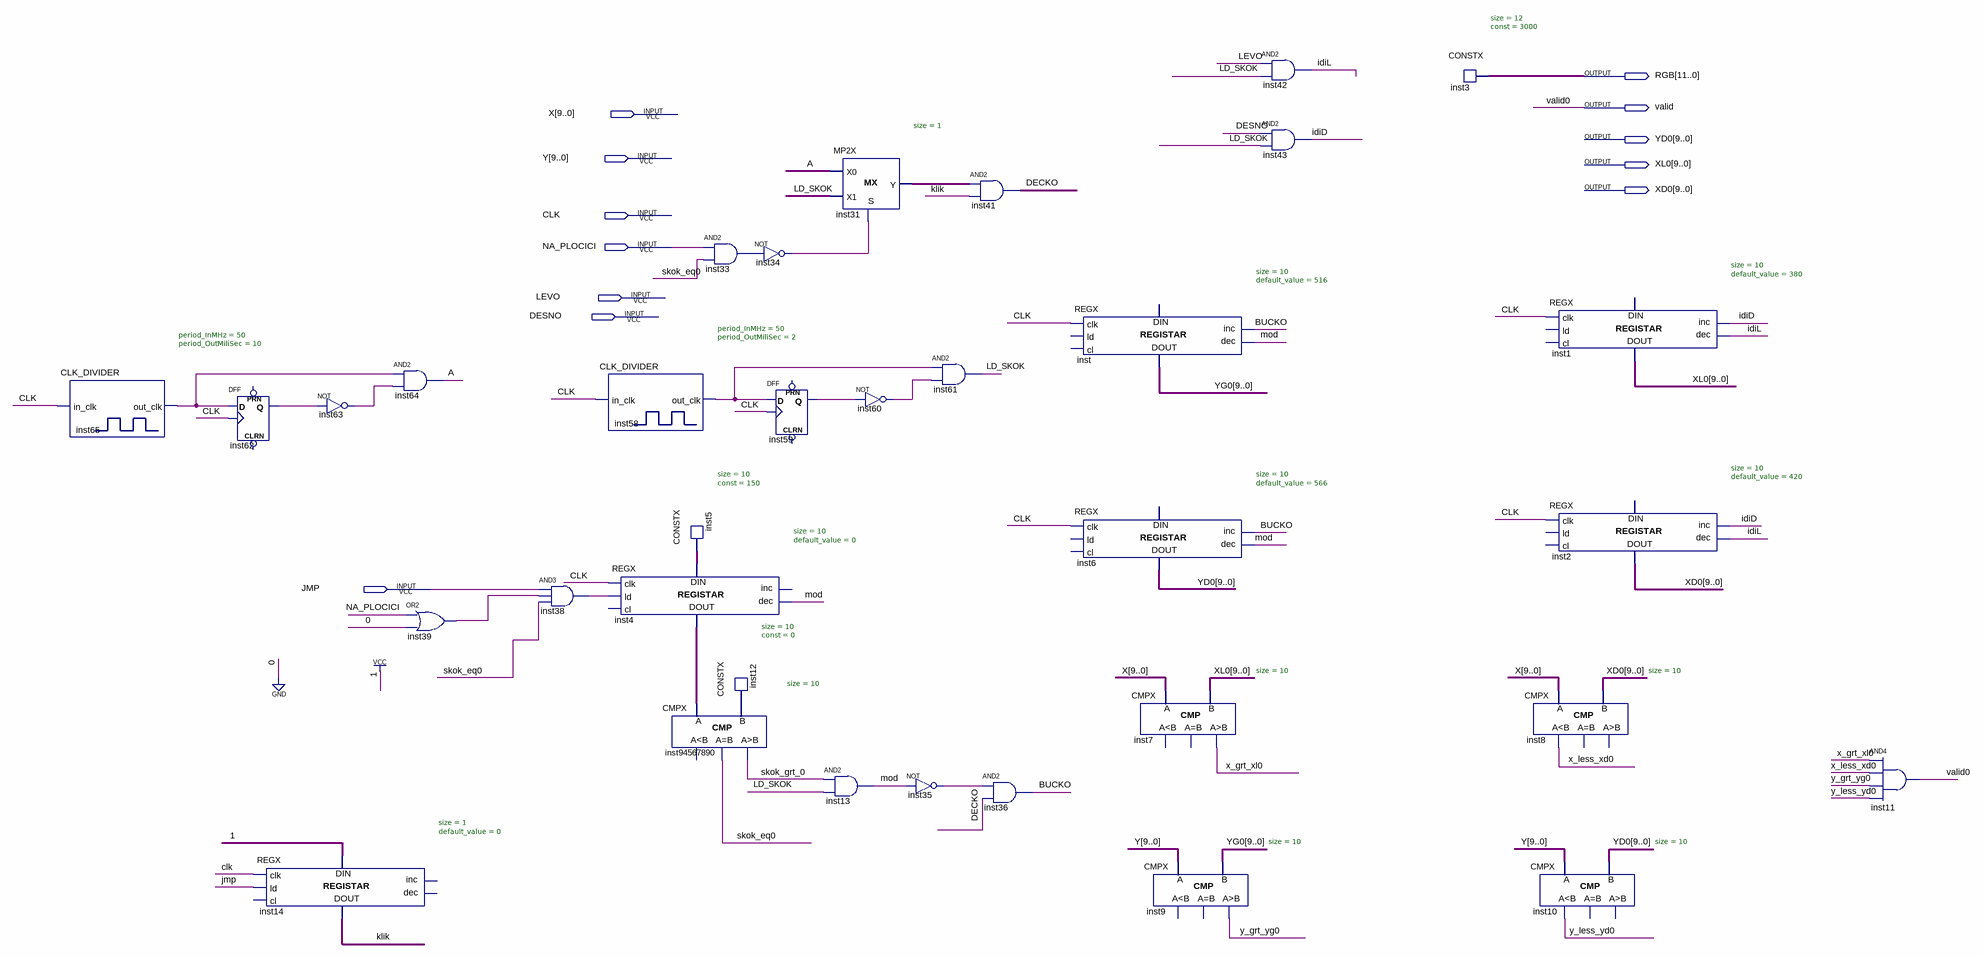
[diagram p0: schematic sheet]
// Quartus schematic cikica.bdf as structural Verilog: 34 symbols, 12 pins
module cikica (
  input  [9:0] X,
  input  [9:0] Y,
  input  CLK,
  input  NA_PLOCICI,
  input  LEVO,
  input  DESNO,
  input  JMP,
  output [11:0] RGB,
  output valid,
  output [9:0] YD0,
  output [9:0] XL0,
  output [9:0] XD0
);

  wire A, BUCKO, DECKO, idiD, idiL, inst31_y, inst33_out, inst34_out, inst35_out, inst38_out, inst39_out,
       inst58_out_clk, inst59_q, inst60_out, inst62_q, inst63_out, inst65_out_clk, klik, LD_SKOK, mod,
       skok_eq0, skok_grt_0, x_grt_xl0, x_less_xd0, y_grt_yg0, y_less_yd0;
  wire [9:0] inst4_data_out, inst5_data, inst12_data, YG0;

  CLK_DIVIDER #(.period_InMHz(50), .period_OutMiliSec(10)) inst65 (.in_clk(CLK), .out_clk(inst65_out_clk));
  DFF inst62 (.CLK(CLK), .D(inst65_out_clk), .Q(inst62_q));  // open: CLRN, PRN
  REGX #(.size(1), .default_value(0)) inst14 (
    .clk(CLK), .ld(JMP), .data_in(1'b1), .data_out(klik));  // open: cl, inc, dec
  not inst63 (inst63_out, inst62_q);
  and inst64 (A, inst65_out_clk, inst63_out);
  or inst39 (inst39_out, NA_PLOCICI, 1'b0);
  and inst38 (inst38_out, JMP, inst39_out, skok_eq0);
  CLK_DIVIDER #(.period_InMHz(50), .period_OutMiliSec(2)) inst58 (.in_clk(CLK), .out_clk(inst58_out_clk));
  REGX #(.size(10), .default_value(0)) inst4 (
    .clk(CLK), .ld(inst38_out), .dec(mod), .data_in(inst5_data), .data_out(inst4_data_out));  // open: cl, inc
  CMPX #(.size(10)) inst94567890 (.A(inst4_data_out), .B(inst12_data), .eq(skok_eq0), .gr(skok_grt_0));  // open: ls
  and inst33 (inst33_out, NA_PLOCICI, skok_eq0);
  CONSTX #(.size(10), .\const (150)) inst5 (.data(inst5_data));
  not inst34 (inst34_out, inst33_out);
  CONSTX #(.size(10), .\const (0)) inst12 (.data(inst12_data));
  DFF inst59 (.CLK(CLK), .D(inst58_out_clk), .Q(inst59_q));  // open: CLRN, PRN
  MP2X #(.size(1)) inst31 (.S(inst34_out), .X0(A), .X1(LD_SKOK), .Y(inst31_y));
  not inst60 (inst60_out, inst59_q);
  and inst13 (mod, skok_grt_0, LD_SKOK);
  not inst35 (inst35_out, mod);
  and inst61 (LD_SKOK, inst58_out_clk, inst60_out);
  and inst41 (DECKO, inst31_y, klik);
  and inst36 (BUCKO, inst35_out, DECKO);
  REGX #(.size(10), .default_value(516)) inst (
    .clk(CLK), .inc(BUCKO), .dec(mod), .data_out(YG0));  // open: ld, cl, data_in
  REGX #(.size(10), .default_value(566)) inst6 (
    .clk(CLK), .inc(BUCKO), .dec(mod), .data_out(YD0));  // open: ld, cl, data_in
  CMPX #(.size(10)) inst7 (.A(X), .B(XL0), .gr(x_grt_xl0));  // open: ls, eq
  CMPX #(.size(10)) inst9 (.A(Y), .B(YG0), .gr(y_grt_yg0));  // open: ls, eq
  and inst42 (idiL, LEVO, LD_SKOK);
  and inst43 (idiD, DESNO, LD_SKOK);
  CONSTX #(.size(12), .\const (3000)) inst3 (.data(RGB));
  CMPX #(.size(10)) inst8 (.A(X), .B(XD0), .ls(x_less_xd0));  // open: eq, gr
  REGX #(.size(10), .default_value(380)) inst1 (
    .clk(CLK), .inc(idiD), .dec(idiL), .data_out(XL0));  // open: ld, cl, data_in
  REGX #(.size(10), .default_value(420)) inst2 (
    .clk(CLK), .inc(idiD), .dec(idiL), .data_out(XD0));  // open: ld, cl, data_in
  CMPX #(.size(10)) inst10 (.A(Y), .B(YD0), .ls(y_less_yd0));  // open: eq, gr
  and inst11 (valid, x_grt_xl0, x_less_xd0, y_grt_yg0, y_less_yd0);

  // Other names for the same wires on the sheet: valid0 = valid
endmodule
